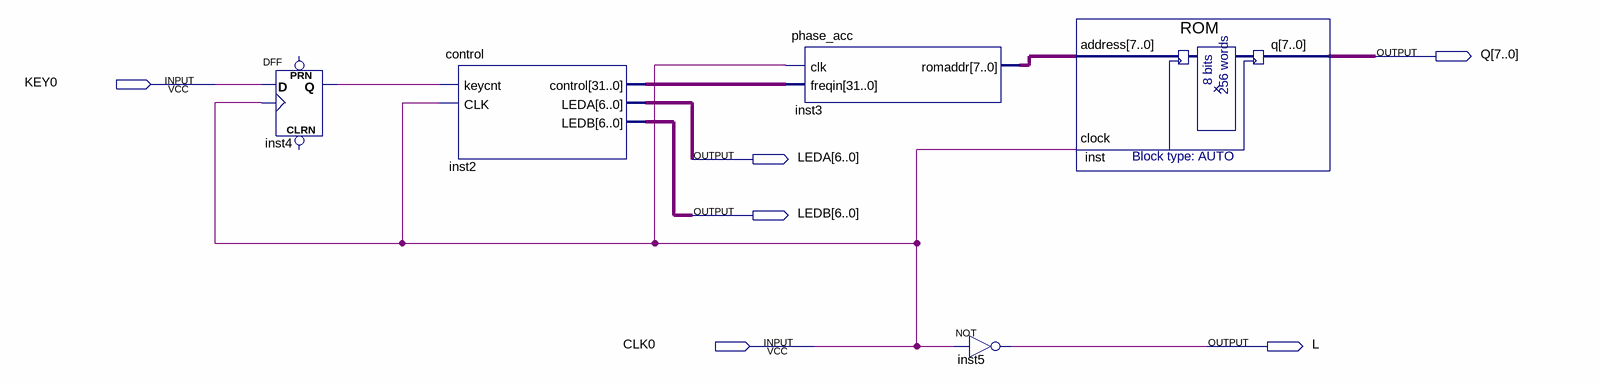
[diagram p0: schematic sheet]
// Quartus schematic mydds.bdf as structural Verilog: 5 symbols, 6 pins
module mydds (
  input  KEY0,
  input  CLK0,
  output [7:0] Q,
  output [6:0] LEDA,
  output [6:0] LEDB,
  output L
);

  wire inst4_q;
  wire [7:0] inst3_romaddr;
  wire [31:0] inst2_control;

  DFF inst4 (.CLK(CLK0), .D(KEY0), .Q(inst4_q));  // open: CLRN, PRN
  control inst2 (.keycnt(inst4_q), .CLK(CLK0), .control(inst2_control), .LEDA(LEDA), .LEDB(LEDB));
  phase_acc inst3 (.clk(CLK0), .freqin(inst2_control), .romaddr(inst3_romaddr));
  not inst5 (L, CLK0);
  ROM inst (.address(inst3_romaddr), .clock(CLK0), .q(Q));
endmodule
